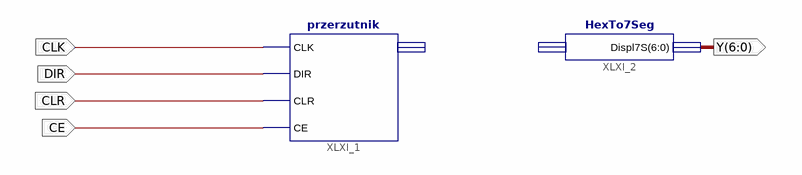
[diagram p0: schematic sheet 1]
// Xilinx ISE schematic hex3.sch (xc9500xl) as structural Verilog: 2 symbols, 5 ports
module hex3 (
  input  CLK,
  input  DIR,
  input  CLR,
  input  CE,
  output [6:0] Y
);

  przerzutnik XLXI_1 (.CLK(CLK), .DIR(DIR), .CLR(CLR), .CE(CE));  // open: Q
  HexTo7Seg XLXI_2 (.Displ7S(Y));  // open: Hex
endmodule
